# EAGLE design MachineLearning-MM-Carrier (EAGLE 9.6.2)
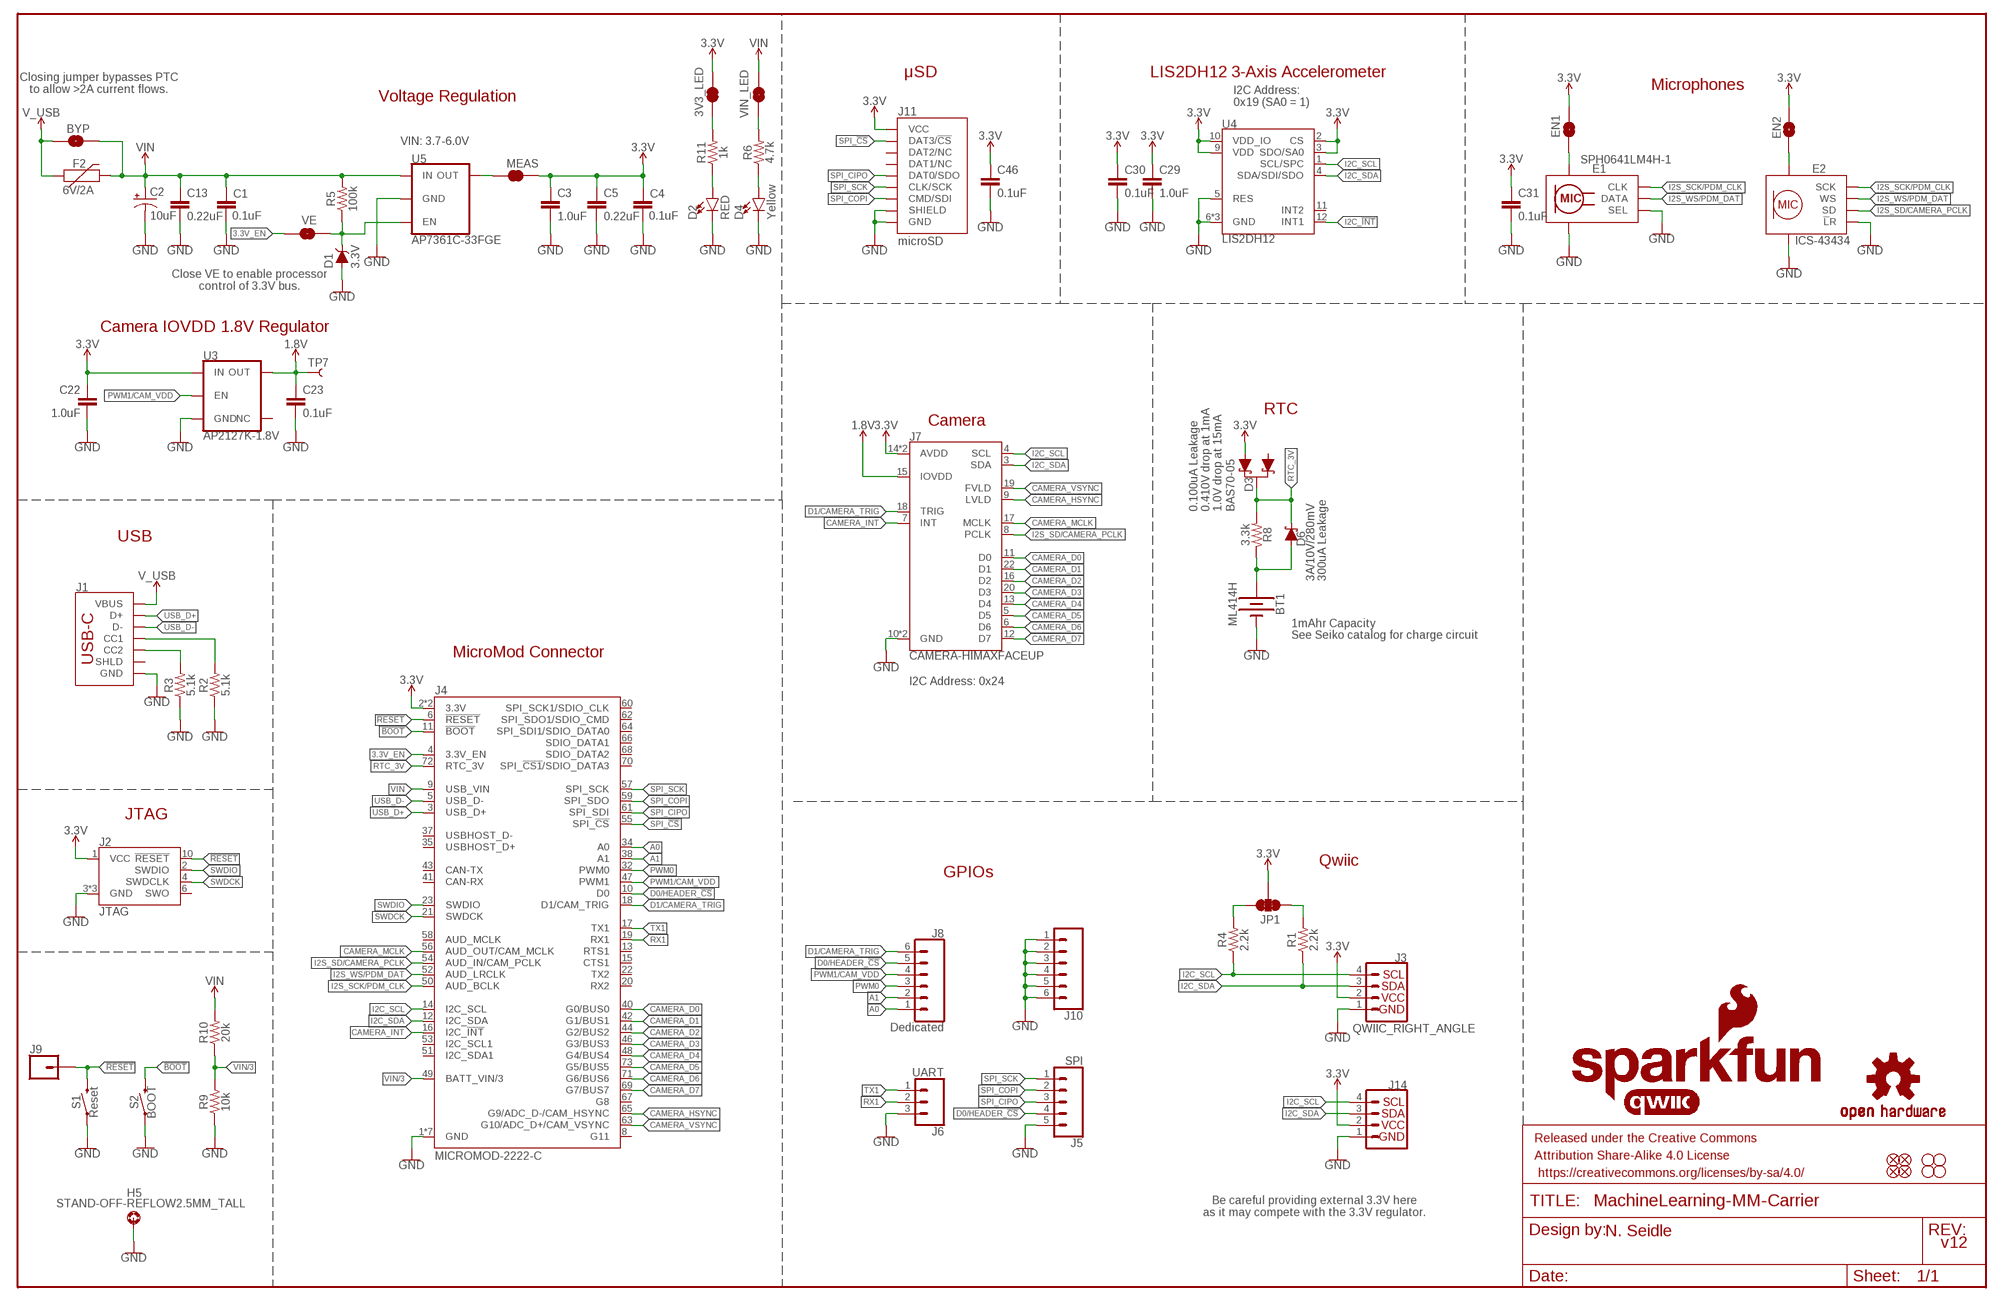
[diagram p0: schematic, sheet 1]

## Parts
3V3_LED  JUMPER-SMT_2_NC_TRACE_SILK  [SMT-JUMPER_2_NC_TRACE_SILK]
BT1  ML414H  ML414H_IV01E_BATTERY  [ML414H_IV01E]
BYP  JUMPER-SMT_2_NO_SILK  [SMT-JUMPER_2_NO_SILK]
C1  0.1uF  0.1UF-0603-25V-(+80/-20%)  [0603]
C2  10uF  10UF-POLAR-EIA3216-16V-10%(TANT)  [EIA3216]
C3  1.0uF  1.0UF-0603-16V-10%  [0603]
C4  0.1uF  0.1UF-0603-25V-(+80/-20%)  [0603]
C5  0.22uF  0.22UF-0603-25V-10%  [0603]
C13  0.22uF  0.22UF-0603-25V-10%  [0603]
C22  1.0uF  1.0UF-0603-16V-10%  [0603]
C23  0.1uF  0.1UF-0603-100V-10%  [0603]
C29  1.0uF  1.0UF-0603-16V-10%  [0603]
C30  0.1uF  0.1UF-0603-25V-(+80/-20%)  [0603]
C31  0.1uF  0.1UF-0603-25V-(+80/-20%)  [0603]
C46  0.1uF  0.1UF-0603-25V-(+80/-20%)  [0603]
D1  3.3V  DIODE-ZENER-MM3Z3V3T1G  [SOD-323]
D2  RED  LED-RED0603  [LED-0603]
D3  BAS70-05  DIODE-SCHOTTKY-DUAL  [SOT23-3]
D4  Yellow  LED-YELLOW0603  [LED-0603]
D6  3A/10V/280mV  DIODE-SCHOTTKY-BAT60A  [SOD-323]
E1  SPH0641LM4H-1  SPH0641LM4H-1_MICROPHONE  [SPH0641LM4H-1_MICROPHONE]
E2  ICS-43434  [ICS-43434]
EN1  JUMPER-SMT_2_NC_TRACE_SILK  [SMT-JUMPER_2_NC_TRACE_SILK]
EN2  JUMPER-SMT_2_NO_SILK  [SMT-JUMPER_2_NO_SILK]
F2  6V/2A  PPTC_6V2A  [1210]
FD1  FIDUCIALUFIDUCIAL  [FIDUCIAL-MICRO]
FD2  FIDUCIALUFIDUCIAL  [FIDUCIAL-MICRO]
FD3  FIDUCIALUFIDUCIAL  [FIDUCIAL-MICRO]
FD4  FIDUCIALUFIDUCIAL  [FIDUCIAL-MICRO]
FRAME1  FRAME-LEDGER  [CREATIVE_COMMONS]
H1  STAND-OFF  [STAND-OFF]
H2  STAND-OFF  [STAND-OFF]
H3  STAND-OFF  [STAND-OFF]
H4  STAND-OFF  [STAND-OFF]
H5  STAND-OFF-REFLOW2.5MM_TALL  [STAND-OFF-REFLOW-M2.5]
J1  USB_C_2-LAYER_PADS  [USB-C-16P-2LAYER-PADS]
J2  JTAG  CORTEX_JTAG_DEBUG_MINIMUM_PTH  [2X5-PTH-1.27MM]
J3  QWIIC_RIGHT_ANGLE  QWIIC_CONNECTORJS-1MM  [JST04_1MM_RA]
J4  MICROMOD-2222-C  [M.2-CONNECTOR-E]
J5  SPI  CONN_05NO_SILK  [1X05_NO_SILK]
J6  UART  CONN_031X03_NO_SILK  [1X03_NO_SILK]
J7  CAMERA-HIMAXFACEUP  [FPC05024-42201]
J8  Dedicated  CONN_06NO_SILK_NO_POP  [1X06_NO_SILK]
J9  CONN_01PTH_NO_SILK_YES_STOP  [1X01_NO_SILK]
J10  CONN_06NO_SILK_NO_POP  [1X06_NO_SILK]
J11  microSD  MICRO-SD-SDIOPUSH-PUSH  [MICRO-SD-SOCKET]
J14  I2C_STANDARD_NO_SILK  [1X04_NO_SILK]
JP1  JUMPER-SMT_3_2-NC_TRACE_SILK  [SMT-JUMPER_3_2-NC_TRACE_SILK]
LOGO1  SFE_LOGO_NAME_FLAME.1_INCH  [SFE_LOGO_NAME_FLAME_.1]
LOGO2  QWIIC_LOGO_CONNECTOR  [QWIIC_5.5MM]
LOGO3  OSHW-LOGOMINI  [OSHW-LOGO-MINI]
MEAS  JUMPER-COMBO_2_NC_TRACE  [COMBO-JUMPER_2_NC_TRACE]
R1  2.2k  2.2KOHM-0603-1/10W-1%  [0603]
R2  5.1k  5.1KOHM5.1KOHM-0603-1/10W-1%  [0603]
R3  5.1k  5.1KOHM5.1KOHM-0603-1/10W-1%  [0603]
R4  2.2k  2.2KOHM-0603-1/10W-1%  [0603]
R5  100k  100KOHM-0603-1/10W-1%  [0603]
R6  4.7k  4.7KOHM-0603-1/10W-1%  [0603]
R8  3.3k  3.3KOHM-0603-1/10W-1%  [0603]
R9  10k  10KOHM-0603-1/10W-1%  [0603]
R10  20k  20KOHM-0603-1/10W-1%  [0603]
R11  1k  1KOHM-0603-1/10W-1%  [0603]
S1  Reset  MOMENTARY-SWITCH-SPST-SMD-5.2-TALL-REDUNDANT  [TACTILE_SWITCH_SMD_5.2MM]
S2  BOOT  MOMENTARY-SWITCH-SPST-SMD-5.2-TALL-REDUNDANT  [TACTILE_SWITCH_SMD_5.2MM]
TP7  TEST-POINT3X5  [PAD.03X.05]
U3  AP2127K-1.8V  V_REG_AP2127K-1.8V  [SOT23-5]
U4  LIS2DH12  [LGA-12-LISDH12]
U5  AP7361C-33FGE  AP7361C-33FGEUDFN-8  [UDFN-8]
VE  JUMPER-SMT_2_NO_SILK  [SMT-JUMPER_2_NO_SILK]
VIN_LED  JUMPER-SMT_2_NC_TRACE_SILK  [SMT-JUMPER_2_NC_TRACE_SILK]

## Nets
1.8V: C23.1 J7.15(IOVDD) TP7.P$1 U3.5(OUT)
3.3V: 3V3_LED.2 C3.1 C4.1 C5.1 C22.1 C29.1 C30.1 C31.1 C46.1 D3.2(A1) EN1.2 EN2.2 J2.1(VCC) J3.2 J4.2(3.3V) J4.74(3.3V) J7.14(AVDD) J7.21(AVDD) J11.VCC J14.2 JP1.2 MEAS.2 MEAS.4 U3.1(IN) U4.2(CS) U4.3(SDO/SA0) U4.9(VDD) U4.10(VDD_IO)
3.3V_EN: J4.4(3.3V_EN) VE.1
!BOOT!: J4.11(!BOOT!) S2.3 S2.4
!RESET!: J2.10(!RESET) J4.6(!RESET!) J9.1 S1.3 S1.4
A0: J4.34(A0) J8.1
A1: J4.38(A1) J8.2
CAMERA_D0: J4.40(G0/BUS0) J7.11(D0)
CAMERA_D1: J4.42(G1/BUS1) J7.22(D1)
CAMERA_D2: J4.44(G2/BUS2) J7.16(D2)
CAMERA_D3: J4.46(G3/BUS3) J7.20(D3)
CAMERA_D4: J4.48(G4/BUS4) J7.13(D4)
CAMERA_D5: J4.73(G5/BUS5) J7.5(D5)
CAMERA_D6: J4.71(G6/BUS6) J7.6(D6)
CAMERA_D7: J4.69(G7/BUS7) J7.12(D7)
CAMERA_HSYNC: J4.65(G9/ADC_D-/CAM_HSYNC) J7.9(LVLD)
CAMERA_INT: J4.16(I2C_!INT!) J7.7(INT)
CAMERA_MCLK: J4.56(AUD_OUT/CAM_MCLK) J7.17(MCLK)
CAMERA_VSYNC: J4.63(G10/ADC_D+/CAM_VSYNC) J7.19(FVLD)
D0/HEADER_!CS!: J4.10(D0) J5.4 J8.5
D1/CAMERA_TRIG: J4.18(D1/CAM_TRIG) J7.18(TRIG) J8.6
GND: BT1.- C1.2 C2.- C3.2 C4.2 C5.2 C13.2 C22.2 C23.2 C29.2 C30.2 C31.2 C46.2 D1.A D2.C D4.C E1.2(SEL) E1.3(GND) E1.6(GND) E1.7(GND) E1.8(GND) E2.2(!L!R) E2.3(GND) E2.7(GND) E2.8(GND) E2.9(GND) H5.1 J1.GND J1.GND2(GND) J2.3(GND) J2.5(GND) J2.9(GND) J3.1 J4.1(GND) J4.7(GND) J4.33(GND) J4.36(GND) J4.39(GND) J4.45(GND) J4.75(GND) J5.5 J6.3 J7.10(GND) J7.23(GND) J10.1 J10.2 J10.3 J10.4 J10.5 J10.6 J11.CD1(SHIELD) J11.GND J11.GND1(GND) J11.GND3(GND) J14.1 R2.1 R3.1 R9.1 S1.1 S1.2 S2.1 S2.2 U3.2(GND) U4.5(RES) U4.6(GND) U4.7(GND) U4.8(GND) U5.4(GND) U5.EP(GND)
I2C_!INT!: U4.12(INT1)
I2C_SCL: J3.4 J4.14(I2C_SCL) J7.4(SCL) J14.4 R4.1 U4.1(SCL/SPC)
I2C_SDA: J3.3 J4.12(I2C_SDA) J7.3(SDA) J14.3 R1.1 U4.4(SDA/SDI/SDO)
I2S_SCK/PDM_CLK: E1.4(CLK) E2.4(SCK) J4.50(AUD_BCLK)
I2S_SD/CAMERA_PCLK: E2.6(SD) J4.54(AUD_IN/CAM_PCLK) J7.8(PCLK)
I2S_WS/PDM_DAT: E1.1(DATA) E2.1(WS) J4.52(AUD_LRCLK)
N$1: R6.2 VIN_LED.1
N$2: JP1.3 R4.2
N$3: JP1.1 R1.2
N$4: E1.5(VDD) EN1.1
N$5: E2.5(VDD) EN2.1
N$6: 3V3_LED.1 R11.2
N$7: D2.A R11.1
N$8: D4.A R6.1
N$10: J1.A5(CC1) R2.2
N$11: J1.B5(CC2) R3.2
N$12: D1.C R5.1 U5.5(EN) VE.2
N$14: BT1.+ D6.A R8.1
PWM0: J4.32(PWM0) J8.3
PWM1/CAM_VDD: J4.47(PWM1) J8.4 U3.3(EN)
RTC_3V: D3.3(C) D6.C J4.72(RTC_3V) R8.2
RX1: J4.19(RX1) J6.2
SPI_!CS!: J4.55(SPI_!CS!) J11.CS/DAT3(DAT3/!CS!)
SPI_CIPO: J4.61(SPI_SDI) J5.3 J11.DO/DAT0(DAT0/SDO)
SPI_COPI: J4.59(SPI_SDO) J5.2 J11.DI/CMD(CMD/SDI)
SPI_SCK: J4.57(SPI_SCK) J5.1 J11.SCLK(CLK/SCK)
SWDCK: J2.4(SWDCLK) J4.21(SWDCK)
SWDIO: J2.2(SWDIO) J4.23(SWDIO)
TX1: J4.17(TX1) J6.1
USB_D+: J1.A6(D+) J1.B6(D+) J4.3(USB_D+)
USB_D-: J1.A7(D-) J1.B7(D-) J4.5(USB_D-)
V_USB: BYP.1 F2.1 J1.VBUS1(VBUS) J1.VBUS2(VBUS)
VIN: BYP.2 C1.1 C2.+ C13.1 F2.2 J4.9(USB_VIN) R5.2 R10.2 U5.8(IN) VIN_LED.2
VIN/3: J4.49(BATT_VIN/3) R9.2 R10.1
VREG_3.3V: MEAS.1 MEAS.3 U5.1(OUT)
Unconnected: D3.1(A) J1.SHLD1(SHLD) J1.SHLD2(SHLD) J1.SHLD3(SHLD) J1.SHLD4(SHLD) J2.6(SWO) J4.8(G11) J4.13(RTS1) J4.15(CTS1) J4.20(RX2) J4.22(TX2) J4.35(USBHOST_D+) J4.37(USBHOST_D-) J4.41(CAN-RX) J4.43(CAN-TX) J4.51(I2C_SDA1) J4.53(I2C_SCL1) J4.58(AUD_MCLK) J4.60(SPI_SCK1/SDIO_CLK) J4.62(SPI_SDO1/SDIO_CMD) J4.64(SPI_SDI1/SDIO_DATA0) J4.66(SDIO_DATA1) J4.67(G8) J4.68(SDIO_DATA2) J4.70(SPI_!CS1!/SDIO_DATA3) J7.MNT1 J7.MNT2 J11.DAT1(DAT1/NC) J11.DAT2(DAT2/NC) U3.4(NC) U4.11(INT2)

## Notes on the sheet
- μSD | LIS2DH12 3-Axis Accelerometer
- Closing jumper bypasses PTC
  to allow >2A current flows.
- Microphones
- Voltage Regulation
- I2C Address:
  0x19 (SA0 = 1)
- VIN: 3.7-6.0V
- Close VE to enable processor
  control of 3.3V bus.
- Camera IOVDD 1.8V Regulator
- RTC
- Camera
- 0.100uA Leakage
  0.410V drop at 1mA
  1.0V drop at 15mA
- USB
- 300uA Leakage
- 1mAhr Capacity
- See Seiko catalog for charge circuit
- MicroMod Connector
- I2C Address: 0x24
- JTAG
- Qwiic
- GPIOs
- Be careful providing external 3.3V here
  as it may compete with the 3.3V regulator.
- N. Seidle
- v12

## Library data of the parts
3V3_LED EN1 VIN_LED = SparkFun-Jumpers:JUMPER-SMT_2_NC_TRACE: Normally closed trace jumper This jumper has a trace between two pads so it's normally closed (NC). Use a razor knife to open the connection. For best results follow the IPC guidelines for cutting traces: Cutout at least 0.063 mm (0.005 in). Remove all loose material to clean up the cut area. Seal the cut with an approved epoxy. Reapply solder to reclose the connection.
BT1 = SparkFun-Batteries:ML414H_IV01E_BATTERY: SEIKO ML414H-IV01E Reflowable Lithium Battery ML414H is a rechargeable, coin type battery with features such as Pb-free reflowable (Peak temperature: 260 C) and high temperature heat resistance. Battery Characteristics: 3.1V max voltage Voff is 2V 1mAH 3k series resistor with battery 72 hour charge time from 2.0-3.1V 2.3-2.8V initial charge; PROD_ID: BATT-14267
BYP EN2 VE = SparkFun-Jumpers:JUMPER-SMT_2_NO: Normally open jumper This jumper has two pads in close proximity to each other. Apply solder to close the connection. Round pads are easier to solder for beginners, but are a lot larger. SparkFun Product that uses the round pads: SparkFun EL Sequencer <https://www.sparkfun.com/products/12781>
C1 C4 C30 C31 C46 = SparkFun-Capacitors:0.1UF: 0.1µF ceramic capacitors A capacitor is a passive two-terminal electrical component used to store electrical energy temporarily in an electric field.; PROD_ID: CAP-00810
C2 = SparkFun-Capacitors:10UF-POLAR: 10.0µF polarized capacitors A capacitor is a passive two-terminal electrical component used to store electrical energy temporarily in an electric field.; PROD_ID: CAP-00811
C3 C22 C29 = SparkFun-Capacitors:1.0UF: 1µF ceramic capacitors A capacitor is a passive two-terminal electrical component used to store electrical energy temporarily in an electric field.; PROD_ID: CAP-00868
C5 C13 = SparkFun-Capacitors:0.22UF: 0.22µF ceramic capacitors A capacitor is a passive two-terminal electrical component used to store electrical energy temporarily in an electric field.; PROD_ID: CAP-07822
C23 = SparkFun-Capacitors:0.1UF: 0.1µF ceramic capacitors A capacitor is a passive two-terminal electrical component used to store electrical energy temporarily in an electric field.; PROD_ID: CAP-08390
D1 = SparkFun-DiscreteSemi:DIODE-ZENER: Zener Diode A Zener diode allows current to flow from its anode to its cathode like a normal semiconductor diode, but it also permits current to flow in the reverse direction when its "Zener voltage" is reached. - WIkipedia; PROD_ID: DIO-11284
D2 = SparkFun-LED:LED-RED: Red SMD LED Used in manufacturing of most products at SparkFun Packages: 0603 - SMD 0603 package [Product Link] <http://docs.avagotech.com/docs/AV02-0551EN> 0603 SMART - SMD 0603 SMART package ( more efficient and expensive)[Product Link] <http://www.osram-os.com/Graphics/XPic2/00077099_0.pdf> 1206 - SMD1206 package [Product Link] <https://www.sparkfun.com/datasheets/DevTools/LilyPad/Q150OVS4.pdff> SparkFun Products: Pro Mini 328 -5V <https://www.sparkfun.com/products/821> RedBoard <https://www.sparkfun.com/products/12757> IOIO-OTG <https://www.sparkfun.com/products/13613>; PROD_ID: DIO-00819
D3 = SparkFun-DiscreteSemi:DIODE-SCHOTTKY-DUAL: Diodes Incorporated - BAS70-05 Dual Schottky Diode Two Schottky Diodes in a single SOT-23 package. Low reverse current (100 nA) Vf: Datasheet referenced for footprint <https://www.diodes.com/assets/Datasheets/ds11007.pdf>; PROD_ID: DIO-14829
D4 = SparkFun-LED:LED-YELLOW: Yellow SMD LED Used in manufacturing several products at SparkFun. Packages: 0603 - SMD 0603 package[Product Link] <http://www.kingbrightusa.com/product.asp?catalog_name=LED&product_id=APT1608SYCK> 0603 -SMART - SMART SMD 0603 package (more efficient/more expensive) [Product Link] <http://www.osram-os.com/osram_os/en/products/product-catalog/led-light-emitting-diodes/smartled-0603/ly-l29k/index.jsp> LilyPad - SMD1206 package[Product Datasheet] <https://www.sparkfun.com/datasheets/DevTools/LilyPad/Q150YUS4.pdf> SparkFun Products: Blynk Board <https://www.sparkfun.com/products/13794> IOIO-OTG <https://www.sparkfun.com/products/13613> XBee Explorer Serial <https://www.sparkfun.com/products/13225>; PROD_ID: DIO-09003
D6 = SparkFun-DiscreteSemi:DIODE-SCHOTTKY: Schottky diode A Schottky diode is a semiconductor diode which has a low forward voltage drop and a very fast switching action.; PROD_ID: DIO-14072
E1 = SparkFun-Sensors:SPH0641LM4H-1_MICROPHONE: SPH0641LM4H-1 Microphone A miniature, high-performance, low power, bottom port silicon digital microphone with a single bit PDM output.; PROD_ID: IC-14361
E2 = Teensy:ICS-43434; PROD_ID: COMP-14898
F2 = SparkFun-Fuses:PPTC: Resettable Fuse PPTC Resettable Fuse. Really a sort of resistor with a polymeric positive temperature coefficient whose resistance increases dramatically with an increase in temperature. When heated by the power passing through the resistance rises causing the current to be limited, protecting the circuit. This is achieved by the transition of the polymer from a crystalline to an amorphous state where the conductive carbon separates breaking the conductive pathways found in the cool crystalline structure. When a PPTC cools back down it resumes conducting letting the circuit turn back on. SparkFun Products: SparkFun RedBoard - Programmed with Arduino <https://www.sparkfun.com/products/12757> Pro Micro - 5V/16MHz <https://www.sparkfun.com/products/12640> Arduino Pro 328 - 5V/16MHz <https://www.sparkfun.com/products/10915> MP3 Trigger <https://www.sparkfun.com/products/13720>; PROD_ID: RES-14313
FD1-FD4 = SparkFun-Aesthetics:FIDUCIAL: Fiducial Alignment Points Point-of-reference for pick-and-place machines and other optical instruments.
FRAME1 = SparkFun-Aesthetics:FRAME-LEDGER: Schematic Frame - Ledger Standard 11x14 US Ledger frame
H1-H4 = SparkFun-Hardware:STAND-OFF: Stand Off Drill holes for mechanically mounting via screws, standoffs, etc. Note: Use the keepout ring to avoid running the screw head into surrounding components. Variant Overviews STAND-OFF - Mechanical footprint for a #4 phillips button head screw. STAND-OFF-TIGHT - Mechanical footprint for a #4 phillips button head screw, Example SparkFun Products Screw - Phillips Head (1/4", 4-40, 10 pack) <https://www.sparkfun.com/products/10453> (PRT-10453) Screw - Phillips Head (1/2", 4-40, 10 pack) <https://www.sparkfun.com/products/10452> (PRT-10452) Screw - Phillips Head (3/4", 4-40, 10 pack) <https://www.sparkfun.com/products/10451> (PRT-10451) Screw - Phillips Head (1", 4-40, 10 pack) <https://www.sparkfun.com/products/10450> (PRT-10450)
H5 = SparkFun-Hardware:STAND-OFF-REFLOW: Stand Off Reflow Compatible A metal standoff that can be placed and reflowed onto a PCB.; PROD_ID: HW-14899
J1 = SparkFun-Connectors:USB_C: USB Type C 16Pin Connector Super Speed pins not available on the 16-pin purely SMD connector so this part is best for USB 2.0 implementations. D1 and D2 are tied together enabling D+/- no matter which way the cable is plugged into the connector. The two channel configuration pins (CC1/2) are exposed. These are normally connected to ground via 5.1k resistors but can be reconfigured for high current/high power applications.; PROD_ID: CONN-14122
J2 = SparkFun-Connectors:CORTEX_JTAG_DEBUG_MINIMUM: Cortex Debug Connector - 10 pin Supports JTAG debug, Serial Wire debug, and Serial Wire Viewer. PTH and SMD connector options available. General Connector Information <http://infocenter.arm.com/help/topic/com.arm.doc.faqs/attached/13634/cortex_debug_connectors.pdf> Products: PTH Connector <http://www.digikey.com/product-detail/en/cnc-tech/3220-10-0100-00/1175-1627-ND/3883661> -via Digi-Key SparkFun PSoc <https://www.sparkfun.com/products/13229> SparkFun T <https://www.sparkfun.com/products/13810>
J3 = SparkFun-Connectors:QWIIC_CONNECTOR: SparkFun I2C Standard Qwiic Connector An SMD 1mm pitch JST connector makes it easy and quick (get it? Qwiic?) to connect I2C devices to each other. The Qwiic system <http://www.sparkfun.com/qwiic> enables fast and solderless connection between popular platforms and various sensors and actuators. We carry 200mm <https://www.sparkfun.com/products/14204>, 100mm <https://www.sparkfun.com/products/14205>, 50mm <https://www.sparkfun.com/products/14206>, and breadboard friendly <https://www.sparkfun.com/products/14207> Qwiic cables. We also offer 10 pcs strips <https://www.sparkfun.com/products/14323> the SMD connectors.; PROD_ID: CONN-13694
J4 = SparkFun-MicroMod:MICROMOD: MicroMod Connector Description: A card edge connector and mating PCB connector to allow various MicroMod Processor Boards to be coupled with various carrier boards of different capabilities. Based on the M.2 standard.; PROD_ID: CONN-14877
J5 = SparkFun-Connectors:CONN_05: Multi connection point. Often used as Generic Header-pin footprint for 0.1 inch spaced/style header connections On any of the 0.1 inch spaced packages, you can populate with these: Break Away Headers - Straight <https://www.sparkfun.com/products/116> (PRT-00116) Break Away Male Headers - Right Angle <https://www.sparkfun.com/products/553> (PRT-00553) Female Headers <https://www.sparkfun.com/products/115> (PRT-00115) Break Away Headers - Machine Pin <https://www.sparkfun.com/products/117> (PRT-00117) Break Away Female Headers - Swiss Machine Pin <https://www.sparkfun.com/products/743> (PRT-00743) For SCREWTERMINALS and SPRING TERMINALS visit here: Screw Terimnals on SparkFun.com <https://www.sparkfun.com/search/results?term=Screw+Terminals> (5mm/3.5mm/2.54mm spacing) This device is also useful as a general connection point to wire up your design to another part of your project. Our various solder wires solder well into these plated through hole pads. Hook-Up Wire - Assortment (Stranded, 22 AWG) <https://www.sparkfun.com/products/11375> (PRT-11375) Hook-Up Wire - Assortment (Solid Core, 22 AWG) <https://www.sparkfun.com/products/11367> (PRT-11367) View the entire wire category on our website here <https://www.sparkfun.com/categories/141> Special notes: Molex polarized connector foot print use with SKU : PRT-08231 with associated crimp pins and housings. 1MM SMD Version SKU: PRT-10208
J6 = SparkFun-Connectors:CONN_03: Multi connection point. Often used as Generic Header-pin footprint for 0.1 inch spaced/style header connections On any of the 0.1 inch spaced packages, you can populate with these: Break Away Headers - Straight <https://www.sparkfun.com/products/116> (PRT-00116) Break Away Male Headers - Right Angle <https://www.sparkfun.com/products/553> (PRT-00553) Female Headers <https://www.sparkfun.com/products/115> (PRT-00115) Break Away Headers - Machine Pin <https://www.sparkfun.com/products/117> (PRT-00117) Break Away Female Headers - Swiss Machine Pin <https://www.sparkfun.com/products/743> (PRT-00743) Stackable Header - 3 Pin (Female, 0.1") <https://www.sparkfun.com/products/13875> (PRT-13875) For SCREWTERMINALS and SPRING TERMINALS visit here: Screw Terimnals on SparkFun.com <https://www.sparkfun.com/search/results?term=Screw+Terminals> (5mm/3.5mm/2.54mm spacing) This device is also useful as a general connection point to wire up your design to another part of your project. Our various solder wires solder well into these plated through hole pads. Hook-Up Wire - Assortment (Stranded, 22 AWG) <https://www.sparkfun.com/products/11375> (PRT-11375) Hook-Up Wire - Assortment (Solid Core, 22 AWG) <https://www.sparkfun.com/products/11367> (PRT-11367) View the entire wire category on our website here <https://www.sparkfun.com/categories/141> Special notes: Molex polarized connector foot print use with SKU : PRT-08232 with associated crimp pins and housings.
J7 = SparkFun-Connectors:CAMERA-HIMAX
J8 J10 = SparkFun-Connectors:CONN_06: Multi connection point. Often used as Generic Header-pin footprint for 0.1 inch spaced/style header connections On any of the 0.1 inch spaced packages, you can populate with these: Break Away Headers - Straight <https://www.sparkfun.com/products/116> (PRT-00116) Break Away Male Headers - Right Angle <https://www.sparkfun.com/products/553> (PRT-00553) Female Headers <https://www.sparkfun.com/products/115> (PRT-00115) Break Away Headers - Machine Pin <https://www.sparkfun.com/products/117> (PRT-00117) Break Away Female Headers - Swiss Machine Pin <https://www.sparkfun.com/products/743> (PRT-00743) Arduino Stackable Header - 6 Pin <https://www.sparkfun.com/products/9280> (PRT-09280) For SCREWTERMINALS and SPRING TERMINALS visit here: Screw Terimnals on SparkFun.com <https://www.sparkfun.com/search/results?term=Screw+Terminals> (5mm/3.5mm/2.54mm spacing) This device is also useful as a general connection point to wire up your design to another part of your project. Our various solder wires solder well into these plated through hole pads. Hook-Up Wire - Assortment (Stranded, 22 AWG) <https://www.sparkfun.com/products/11375> (PRT-11375) Hook-Up Wire - Assortment (Solid Core, 22 AWG) <https://www.sparkfun.com/products/11367> (PRT-11367) View the entire wire category on our website here <https://www.sparkfun.com/categories/141>
J9 = SparkFun-Connectors:CONN_01: Single connection point. Often used as Generic Header-pin footprint for 0.1 inch spaced/style header connections On any of the 0.1 inch spaced packages, you can populate with these: Break Away Headers - Straight <https://www.sparkfun.com/products/116> (PRT-00116) Break Away Male Headers - Right Angle <https://www.sparkfun.com/products/553> (PRT-00553) Female Headers <https://www.sparkfun.com/products/115> (PRT-00115) Break Away Headers - Machine Pin <https://www.sparkfun.com/products/117> (PRT-00117) Break Away Female Headers - Swiss Machine Pin <https://www.sparkfun.com/products/743> (PRT-00743) This device is also useful as a general connection point to wire up your design to another part of your project. Our various solder wires solder well into these plated through hole pads. Hook-Up Wire - Assortment (Stranded, 22 AWG) <https://www.sparkfun.com/products/11375> (PRT-11375) Hook-Up Wire - Assortment (Solid Core, 22 AWG) <https://www.sparkfun.com/products/11367> (PRT-11367) View the entire wire category on our website here <https://www.sparkfun.com/categories/141> Special notes: SMTSO-256-ET is a "flush mount" nut for a 4-40 screw. We mostly use this on specialty testbeds; it is a nice way to connect hardware to your PCB at an adjustable hieght. Also note, the SNAP packages are for using a snappable style connector. We sell a baggie of snaps and they are also used on two LilyPad designs: Snap Assortment - 30 pack (male and female) <https://www.sparkfun.com/products/11347> (DEV-11347) LilyPad Arduino SimpleSnap <https://www.sparkfun.com/products/10941> (DEV-10941) LilyPad SimpleSnap Protoboard <https://www.sparkfun.com/products/10940> (DEV-10940)
J11 = SparkFun-Connectors:MICRO-SD-SDIO: microSD Socket for Transflash Push-push type µSD socket. tDoc lines correctly indicate media card edge positions when inserting (unlocked, locked, depressed). NOTE: CD1 and CD2 are connected internally, and the default detect state of the socket is detect pin to ground. SparkFun Products: WAV Trigger <https://www.sparkfun.com/products/13660> CAN-Bus Shield <https://www.sparkfun.com/products/13262> SparkFun Level Shifing microSD Breakout <https://www.sparkfun.com/products/13743>; PROD_ID: CONN-07820
J14 = SparkFun-Connectors:I2C_STANDARD: SparkFun I2C Standard Pinout Header SparkFun has standardized on a pinout for all I2C based sensor breakouts. This pinout allows I2C boards to be plugged directly into the headers on Arduino Uno compatible boards, and to be daisy chained easily. Example SparkFun Products: SparkFun Atmospheric Sensor Breakout - BME280 <https://www.sparkfun.com/products/13676> SparkFun Altitude/Pressure Sensor Breakout - MPL3115A2 <https://www.sparkfun.com/products/11084> SparkFun TOF Range Finder Sensor - VL6180 <https://www.sparkfun.com/products/12785>
JP1 = SparkFun-Jumpers:JUMPER-SMT_3_2-NC_TRACE: Normally closed trace jumper (2 of 2 connections) This jumper has a trace between all three pads so they are normally closed (NC). Use a razor knife to open the connection(s). For best results follow the IPC guidelines for cutting traces: Cutout at least 0.063 mm (0.005 in). Remove all loose material to clean up the cut area. Seal the cut with an approved epoxy. Reapply solder to reclose the connection(s).
LOGO1 = SparkFun-Aesthetics:SFE_LOGO_NAME_FLAME: SparkFun Font Logo w/ Flame This is the SparkFun full logo. The logo on the schematic will always be the same size; the package variant is the height of the flame part of the logo. Default layer for the logo on the board is tSilk.
LOGO2 = SparkFun-Aesthetics:QWIIC_LOGO: Qwiic Logos for placement on schematic and PCB. The 5.5mm silk logo is best for placing next to Qwiic connector.
LOGO3 = SparkFun-Aesthetics:OSHW-LOGO: Open-Source Hardware (OSHW) Logo This logo indicates the piece of hardware it is found on incorporates a OSHW license and/or adheres to the definition of open source hardware found here: http://freedomdefined.org/OSHW
MEAS = SparkFun-Jumpers:JUMPER-COMBO_2_NC_TRACE
R1 R4 = SparkFun-Resistors:2.2KOHM: 2.2kΩ resistor A resistor is a passive two-terminal electrical component that implements electrical resistance as a circuit element. Resistors act to reduce current flow, and, at the same time, act to lower voltage levels within circuits. - Wikipedia; PROD_ID: RES-08272
R2 R3 = SparkFun-Resistors:5.1KOHM; PROD_ID: RES-12083
R5 = SparkFun-Resistors:100KOHM: 100kΩ resistor A resistor is a passive two-terminal electrical component that implements electrical resistance as a circuit element. Resistors act to reduce current flow, and, at the same time, act to lower voltage levels within circuits. - Wikipedia; PROD_ID: RES-07828
R6 = SparkFun-Resistors:4.7KOHM: 4.7kΩ resistor A resistor is a passive two-terminal electrical component that implements electrical resistance as a circuit element. Resistors act to reduce current flow, and, at the same time, act to lower voltage levels within circuits. - Wikipedia; PROD_ID: RES-07857
R8 = SparkFun-Resistors:3.3KOHM: 3.3kΩ resistor A resistor is a passive two-terminal electrical component that implements electrical resistance as a circuit element. Resistors act to reduce current flow, and, at the same time, act to lower voltage levels within circuits. - Wikipedia; PROD_ID: RES-07851
R9 = SparkFun-Resistors:10KOHM: 10kΩ resistor A resistor is a passive two-terminal electrical component that implements electrical resistance as a circuit element. Resistors act to reduce current flow, and, at the same time, act to lower voltage levels within circuits. - Wikipedia; PROD_ID: RES-00824
R10 = SparkFun-Resistors:20KOHM: 20kΩ resistor A resistor is a passive two-terminal electrical component that implements electrical resistance as a circuit element. Resistors act to reduce current flow, and, at the same time, act to lower voltage levels within circuits. - Wikipedia; PROD_ID: RES-09383
R11 = SparkFun-Resistors:1KOHM: 1kΩ resistor A resistor is a passive two-terminal electrical component that implements electrical resistance as a circuit element. Resistors act to reduce current flow, and, at the same time, act to lower voltage levels within circuits. - Wikipedia; PROD_ID: RES-07856
S1 S2 = SparkFun-Switches:MOMENTARY-SWITCH-SPST: Momentary Switch (Pushbutton) - SPST Normally-open (NO) SPST momentary switches (buttons, pushbuttons). Variants PTH-12MM - 12mm square, through-hole Momentary Pushbutton Switch - 12mm Square <https://www.sparkfun.com/products/9190> (COM-09190) PTH-6.0MM, PTH-6.0MM-KIT - 6.0mm square, through-hole Mini Pushbutton Switch <https://www.sparkfun.com/products/97> (COM-00097) KIT package intended for soldering kit's - only one side of pads' copper is exposed. PTH-RIGHT-ANGLE-KIT - Right-angle, through-hole Right Angle Tactile Button <https://www.sparkfun.com/products/10791> - Used on SparkFun BigTime Watch Kit <https://www.sparkfun.com/products/11734> SMD-12MM - 12mm square, surface-mount Tactile Button - SMD (12mm) <https://www.sparkfun.com/products/12993> (COM-12993) Used on SparkFun PicoBoard <https://www.sparkfun.com/products/11888> SMD-4.5MM - 4.5mm Square Trackball Switch Used on SparkFun Blackberry Trackballer Breakout <https://www.sparkfun.com/products/13169> SMD-4.6MMX2.8MM - 4.60mm x 2.80mm, surface mount Used on SparkFun SAMD21 Mini Breakout <https://www.sparkfun.com/products/13664> SMD-5.2MM, SMD-5.2-REDUNDANT - 5.2mm square, surface-mount Mini Pushbutton Switch - SMD <https://www.sparkfun.com/products/8720> (COM-08720) Used on Arduino Pro Mini <https://www.sparkfun.com/products/11114> REDUNDANT package connects both switch circuits together SMD-6.0X3.5MM - 6.0 x 3.5mm, surface mount Momentary Reset Switch SMD <https://www.sparkfun.com/products/8229> (COM-08229) SMD-6.2MM-TALL - 6.2mm square, surface mount Tactile Button - SMD (6mm) <https://www.sparkfun.com/products/12992> Used on SparkFun Digital Sandbox <https://www.sparkfun.com/products/12651> SMD-RIGHT-ANGLE - Right-angle, surface mount Used on SparkFun Block for Intel® Edison - Arduino <https://www.sparkfun.com/products/13036>; PROD_ID: SWCH-14139
TP7 = SparkFun-Connectors:TEST-POINT: SparkFun Test Points Bare copper test points for troubleshooting or In-Circuit-Testing. These are used by our Production team for verifying production board runs using pogo-pins on test beds. SparkFun Products: SparkFun LSM9DS1 Breakout <https://www.sparkfun.com/products/13284> SparkFun PSOC <https://www.sparkfun.com/products/13714> SparkFun Load Cell Amplifier <https://www.sparkfun.com/products/13879>
U3 = SparkFun-IC-Power:V_REG_AP2127: AP2127 - 300mA CMOS LDO Regulator w/ Enable The AP2127 is CMOS process low dropout linear regulator with enable function, the regulator delivers a guaranteed 300mA (min.) continuous load current. Features Output Voltage Accuracy: ±1.5% Output Current: 300mA (Min.) Foldback Short Current Protection: 50mA Enable Function to Turn ON/OFF VOUT Low Dropout Voltage (3.3V): 250mV (Typ.) @IOUT=600mA Excellent Load Regulation: 0.2%/A (Typ.) Excellent Line Regulation: 0.02%/V (Typ.) Low Quiescent Current: 55μA (Typ.) Low Standby Current: 0.01μA (Typ.) Low Output Noise: 50μVRMS PSRR: 100Hz -65dB, 1kHz -65dB OTSD Protection Stable with 1.0μF Flexible Cap: Ceramic, Tantalum and Aluminum Electrolytic Operation Temperature Range: -40°C to 85°C ESD: MM 400V, HBM 4000V; PROD_ID: VREG-14239
U4 = SparkFun-Sensors:LIS2DH12; DIGIKEY: 497-14851-2-ND; PROD_ID: IC-14229
U5 = SparkFun-IC-Power:AP7361C-33FGE: AP7361C 3.3V LDO Regulator; PROD_ID: VREG-14094

## Net classes
0 default: width 0 mm, drill 0 mm
1 power: width 0.762 mm

## Board
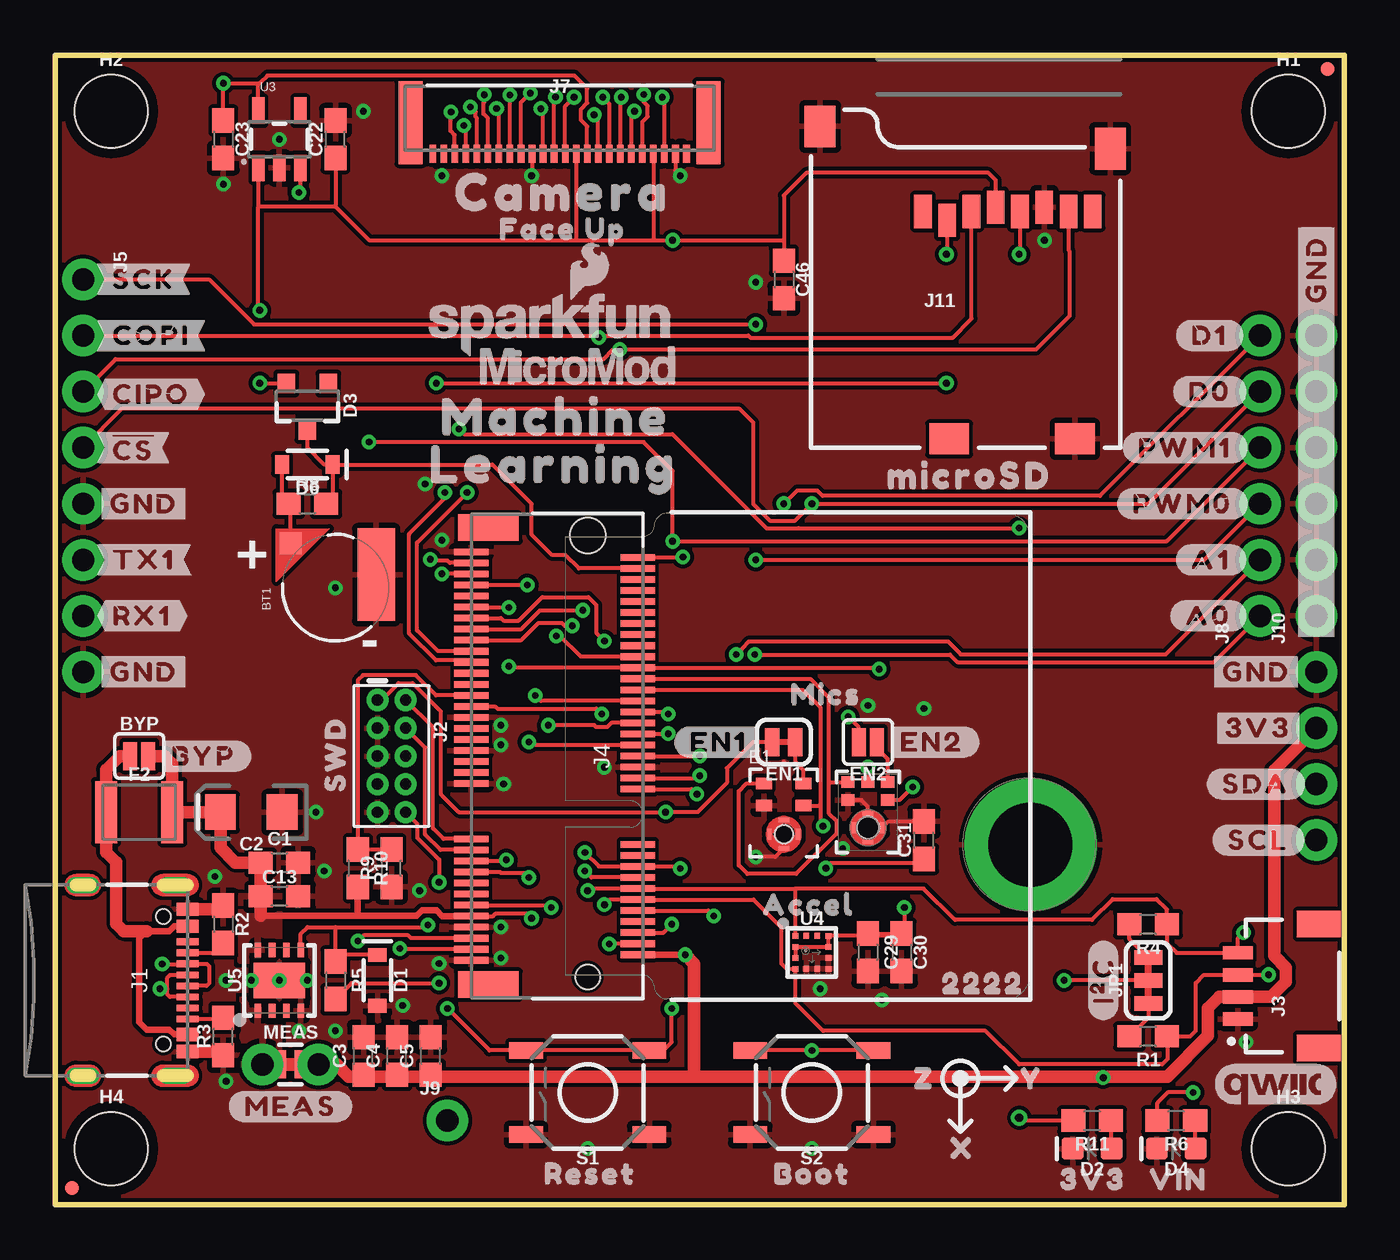
[diagram p1: board, top side]
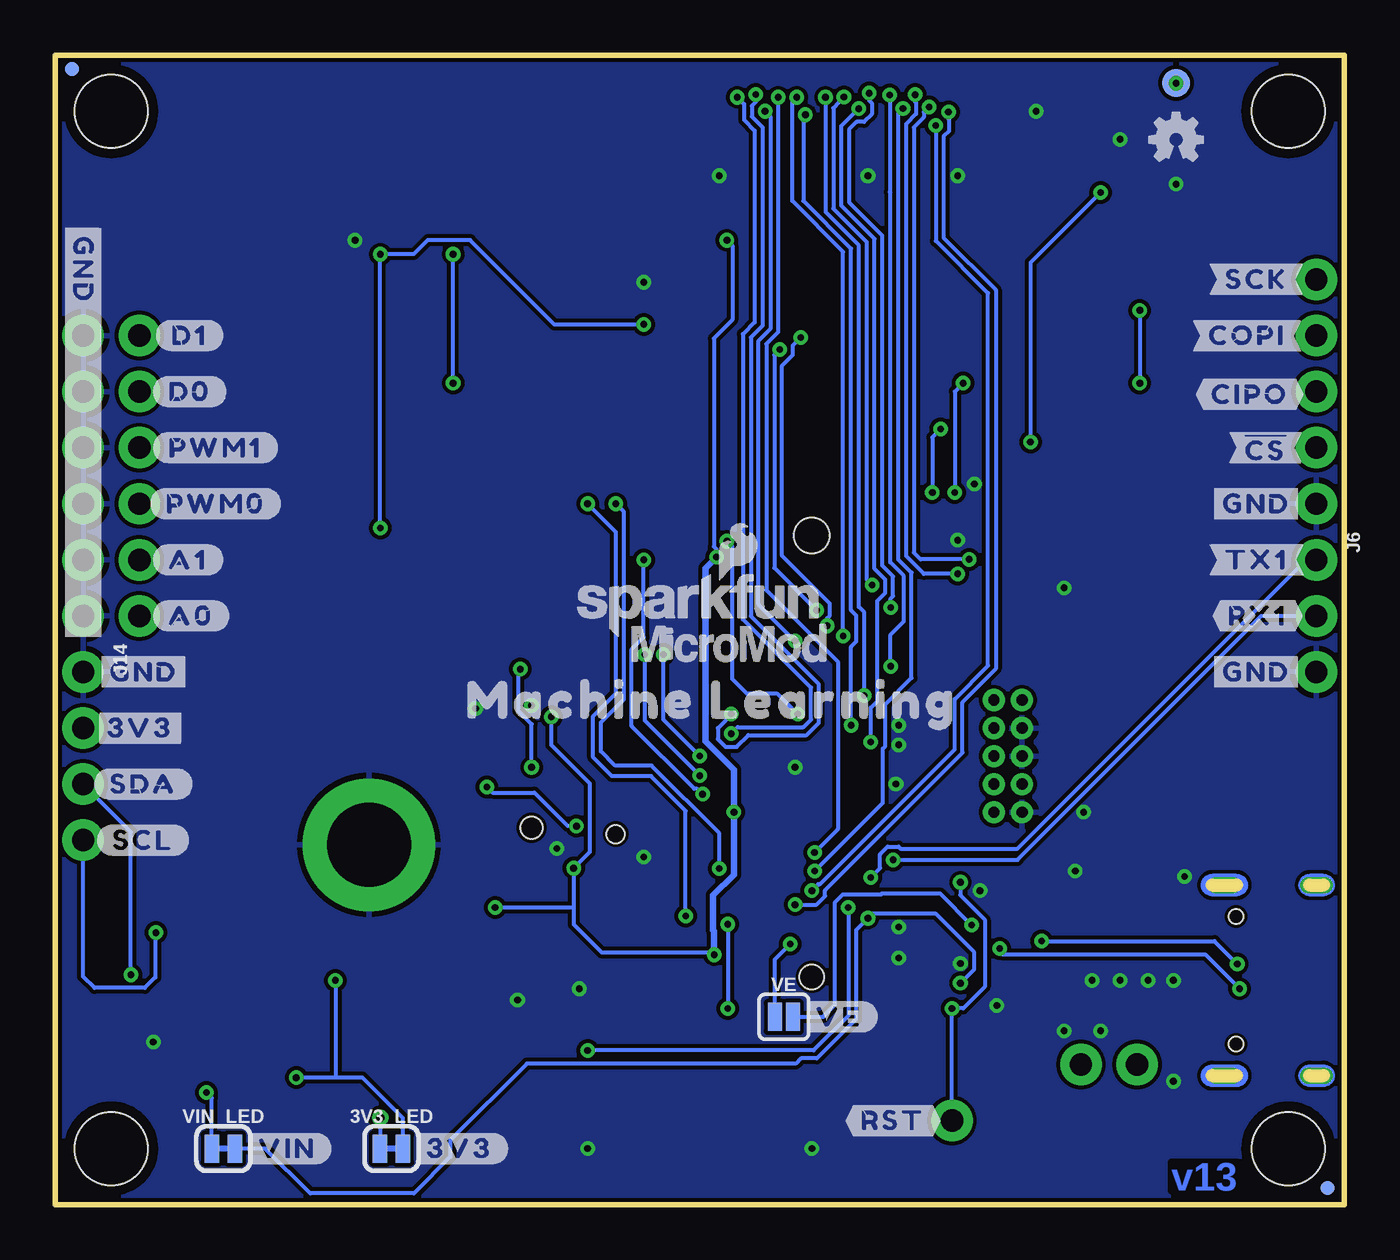
[diagram p2: board, bottom side, seen from below]

Size 58.42 x 52.07 mm. Coordinates in mm from the lower left corner, seen from the top.
Outline: 0,0 0,52.07 58.42,52.07 58.42,0 0,0
Copper layers (1*16): Top 0.035mm / dielectric 1.5mm / Bottom 0.035mm
Design rules "SparkFun-2-layer-TIGHT *": minimum track width 7mil, minimum drill 12mil, track to track 7mil, track to pad 7mil, pad to pad 7mil, via to via 7mil, smd to smd 7mil, copper to edge 7mil, drill to drill 7mil, minimum pad ring 7mil, minimum via ring 7mil, stop-mask expansion 4mil, vias tented up to drill 25mil, thermal gap 10mil

### Footprints (pad centres in the part's own frame; a part is rotated, then mirrored left to right if it is on the bottom)
SMT-JUMPER_2_NC_TRACE_SILK = smd 0.66 x 1.27: 1 -0.521,0; 2 0.521,0
ML414H_IV01E = smd 1 x 1: + 2.022,2.032 | smd 4.2 x 1.7: - 0.6,-1.85
SMT-JUMPER_2_NO_SILK = smd 0.635 x 1.27: 1 -0.406,0; 2 0.406,0
0603 = smd 1.1 x 1: 1 -0.85,0; 2 0.85,0
EIA3216 = smd 1.4 x 1.6: + 1.4,0; - -1.4,0
SOD-323 = smd 0.63 x 0.83: A 1.15,0; C -1.15,0
LED-0603 = smd 1 x 1: A -0.877,0; C 0.877,0
SOT23-3 = smd 0.8 x 0.9: 1 -0.95,-1; 2 0.95,-1; 3 0,1.1
SPH0641LM4H-1_MICROPHONE = smd 0.725 x 0.522: 1 -0.9,1.3; 2 -0.9,0.3; 4 0.9,0.3; 5 0.9,1.3 | smd 0.5 x 0.2: 3 0,-1.65; 8 0,-0.35 | smd 0.2 x 0.5: 6 -0.65,-1; 7 0.65,-1 | hole 0.8: 0,-1
ICS-43434 = smd 0.522 x 0.6: 1 -1.364,-0.9; 2 -0.542,-0.9; 4 -0.542,0.9; 5 -1.364,0.9; 6 -1.364,0 | smd 0.2 x 0.5: 3 1.36,0; 8 0.06,0 | smd 0.5 x 0.2: 7 0.71,0.65; 9 0.71,-0.65 | hole 1: 0.71,0
1210 = smd 1 x 2.8: 1 -1.5,0; 2 1.5,0
FIDUCIAL-MICRO = smd 0.635 x 0.635: 1 0,0
STAND-OFF = hole 3.302: 0,0
STAND-OFF-REFLOW-M2.5 = drill 3.8 pad 6: 1 0,0
USB-C-16P-2LAYER-PADS = smd 0.3 x 1: A5 -1.25,-0.34; A6 -0.25,-0.34; A7 0.25,-0.34; A8 1.25,-0.34; B5 1.75,-0.34; B6 0.75,-0.34; B7 -0.75,-0.34; B8 -1.75,-0.34 | smd 0.6 x 1: GND -3.225,-0.34; GND2 3.225,-0.34; VBUS1 -2.45,-0.34; VBUS2 2.45,-0.34 | drill 0.4 pad 0.6 long: SHLD1 -4.318,-0.915; SHLD2 4.318,-0.915; SHLD3 -4.318,-5.095; SHLD4 4.318,-5.095 | hole 0.65: -2.89,-1.445; 2.89,-1.445
2X5-PTH-1.27MM = drill 0.508 pad 1: 1 -2.54,-0.635; 2 -2.54,0.635; 3 -1.27,-0.635; 4 -1.27,0.635; 5 0,-0.635; 6 0,0.635; 7 1.27,-0.635; 8 1.27,0.635; 9 2.54,-0.635; 10 2.54,0.635
JST04_1MM_RA = smd 0.6 x 1.35: 1 -1.5,0; 2 -0.5,0; 3 0.5,0; 4 1.5,0 | smd 1.2 x 2: NC1 2.8,-3.675; NC2 -2.8,-3.675
M.2-CONNECTOR-E = smd 0.3 x 1.55: 1 9.25,-5.275; 2 9,2.275; 3 8.75,-5.275; 4 8.5,2.275; 5 8.25,-5.275; 6 8,2.275; 7 7.75,-5.275; 8 7.5,2.275; 9 7.25,-5.275; 10 7,2.275; 11 6.75,-5.275; 12 6.5,2.275; 13 6.25,-5.275; 14 6,2.275; 15 5.75,-5.275; 16 5.5,2.275; 17 5.25,-5.275; 18 5,2.275; 19 4.75,-5.275; 20 4.5,2.275; 21 4.25,-5.275; 22 4,2.275; 23 3.75,-5.275; 32 1.5,2.275; 33 1.25,-5.275; 34 1,2.275; 35 0.75,-5.275; 36 0.5,2.275; 37 0.25,-5.275; 38 0,2.275; 39 -0.25,-5.275; 40 -0.5,2.275; 41 -0.75,-5.275; 42 -1,2.275; 43 -1.25,-5.275; 44 -1.5,2.275; 45 -1.75,-5.275; 46 -2,2.275; 47 -2.25,-5.275; 48 -2.5,2.275; 49 -2.75,-5.275; 50 -3,2.275; 51 -3.25,-5.275; 52 -3.5,2.275; 53 -3.75,-5.275; 54 -4,2.275; 55 -4.25,-5.275; 56 -4.5,2.275; 57 -4.75,-5.275; 58 -5,2.275; 59 -5.25,-5.275; 60 -5.5,2.275; 61 -5.75,-5.275; 62 -6,2.275; 63 -6.25,-5.275; 64 -6.5,2.275; 65 -6.75,-5.275; 66 -7,2.275; 67 -7.25,-5.275; 68 -7.5,2.275; 69 -7.75,-5.275; 70 -8,2.275; 71 -8.25,-5.275; 72 -8.5,2.275; 73 -8.75,-5.275; 74 -9,2.275; 75 -9.25,-5.275 | smd 1.2 x 2.75: A1 10.35,-4.5; A2 -10.35,-4.5 | hole 1.1: 10,0 | hole 1.6: -10,0
1X05_NO_SILK = drill 1.016 pad 1.88: 1 0,0; 2 2.54,0; 3 5.08,0; 4 7.62,0; 5 10.16,0
1X03_NO_SILK = drill 1.016 pad 1.88: 1 0,0; 2 2.54,0; 3 5.08,0
FPC05024-42201 = smd 0.3 x 0.8: 1 5.75,0.4; 2 5.25,0.4; 3 4.75,0.4; 4 4.25,0.4; 5 3.75,0.4; 6 3.25,0.4; 7 2.75,0.4; 8 2.25,0.4; 9 1.75,0.4; 10 1.25,0.4; 11 0.75,0.4; 12 0.25,0.4; 13 -0.25,0.4; 14 -0.75,0.4; 15 -1.25,0.4; 16 -1.75,0.4; 17 -2.25,0.4; 18 -2.75,0.4; 19 -3.25,0.4; 20 -3.75,0.4; 21 -4.25,0.4; 22 -4.75,0.4; 23 -5.25,0.4; 24 -5.75,0.4 | smd 1.1 x 3.75: MNT1 -6.75,-1; MNT2 6.75,-1
1X06_NO_SILK = drill 1.016 pad 1.88: 1 0,0; 2 2.54,0; 3 5.08,0; 4 7.62,0; 5 10.16,0; 6 12.7,0
1X01_NO_SILK = drill 1.016 pad 1.88: 1 0,0
MICRO-SD-SOCKET = smd 1.8 x 1.4: CD1 -2.05,0.4; CD2 -7.75,0.4 | smd 0.8 x 1.5: CS/DAT3 -7.84,10.3; DAT1 -1.24,10.7; DAT2 -8.94,10.7; DI/CMD -6.74,10.7; DO/DAT0 -2.34,10.7; GND -3.44,10.9; SCLK -4.54,10.7; VCC -5.64,10.9 | smd 1.4 x 1.9: GND1 -13.6,14.55; GND3 -0.45,13.55
1X04_NO_SILK = drill 1.016 pad 1.88: 1 0,0; 2 2.54,0; 3 5.08,0; 4 7.62,0
SMT-JUMPER_3_2-NC_TRACE_SILK = smd 0.66 x 1.27: 1 -1.041,0; 2 0,0; 3 1.041,0
COMBO-JUMPER_2_NC_TRACE = smd 0.635 x 1.27: 1 -0.508,0; 2 0.508,0 | drill 1.016 pad 1.88: 3 -1.27,0; 4 1.27,0
TACTILE_SWITCH_SMD_5.2MM = smd 1.524 x 0.762: 1 -2.794,1.905; 2 2.794,1.905; 3 -2.794,-1.905; 4 2.794,-1.905
PAD.03X.05 = smd 1.27 x 1.27: P$1 0,0
SOT23-5 = smd 0.55 x 1.2: 1 -0.95,-1.3; 2 0,-1.3; 3 0.95,-1.3; 4 0.95,1.3; 5 -0.95,1.3
LGA-12-LISDH12 = smd 0.275 x 0.25: 1 -0.75,0.75; 2 -0.75,0.25; 3 -0.75,-0.25; 4 -0.75,-0.75; 7 0.75,-0.75; 8 0.75,-0.25; 9 0.75,0.25; 10 0.75,0.75 | smd 0.25 x 0.275: 5 -0.25,-0.75; 6 0.25,-0.75; 11 0.25,0.75; 12 -0.25,0.75
UDFN-8 = smd 0.3 x 0.65: 1 -0.975,-1.375; 2 -0.325,-1.375; 3 0.325,-1.375; 4 0.975,-1.375; 5 0.975,1.375; 6 0.325,1.375; 7 -0.325,1.375; 8 -0.975,1.375 | smd 2.35 x 1.6: EP 0,0

### Placement (x,y rotation side)
3V3_LED  43.18,2.54 0 bottom
BT1  12.7,27.94 90 top
BYP  3.81,20.32 0 top
C1  10.16,15.49 0 top
C2  8.89,17.78 180 top
C3  13.97,6.73 90 top
C4  15.49,6.73 90 top
C5  17.02,6.73 90 top
C13  10.16,13.97 0 top
C22  12.7,48.26 90 top
C23  7.62,48.26 270 top
C29  36.83,11.43 270 top
C30  38.35,11.43 270 top
C31  39.37,16.51 90 top
C46  33.02,41.91 270 top
D1  14.61,10.16 270 top
D2  46.99,2.54 180 top
D3  11.43,36.2 180 top
D4  50.8,2.54 180 top
D6  11.43,33.53 180 top
E1  33.02,17.78 0 top
E2  36.83,17.78 270 top
EN1  33.02,20.95 180 top
EN2  36.83,20.95 180 top
F2  3.81,17.78 0 top
FD1  0.76,0.76 0 top
FD2  57.66,51.44 0 top
FD3  0.76,0.76 0 bottom
FD4  57.66,51.44 0 bottom
FRAME1  1.27,-10.16 0 top  (outside the outline)
H1  55.88,49.53 0 top
H2  2.54,49.53 0 top
H3  55.88,2.54 0 top
H4  2.54,2.54 0 top
H5  44.2,16.3 0 top
J1  6.35,10.16 270 top
J2  15.24,20.32 270 top
J3  53.59,9.91 90 top
J4  24.13,20.32 270 top
J5  1.27,41.91 270 top
J6  1.27,29.21 270 bottom
J7  22.86,48.01 180 top
J8  54.61,26.67 90 top
J9  17.78,3.81 0 top
J10  57.15,26.67 90 top
J11  48.26,34.29 0 top
J14  57.15,24.13 270 bottom
JP1  49.53,10.16 90 top
LOGO1  22.48,39.88 0 top
LOGO2  55.31,5.46 0 top
LOGO3  7.62,48.26 0 bottom
LOGO4  SFE_LOGO_NAME_FLAME.1_INCH  [SFE_LOGO_NAME_FLAME_.1]  29.21,27.18 0 bottom
MEAS  10.67,6.35 0 top
R1  49.53,7.62 180 top
R2  7.62,12.7 270 top
R3  7.62,7.62 90 top
R4  49.53,12.7 180 top
R5  12.7,10.16 270 top
R6  50.8,3.81 180 top
R8  11.43,31.75 0 top
R9  15.24,15.24 90 top
R10  13.72,15.24 270 top
R11  46.99,3.81 180 top
S1  24.13,5.08 180 top
S2  34.29,5.08 180 top
TP7  7.62,50.8 0 bottom
U3  10.16,48.26 0 top
U4  34.29,11.43 0 top
U5  10.16,10.16 0 top
U$1  [#EN1#3]  28.07,20.95 0 top
U$2  [#EN2#4]  37.59,20.95 0 top
U$3  [CAMERA0]  16.89,45.85 0 top
U$4  [#3V3#0]  42.29,2.54 0 bottom
U$5  [MICS0]  32.64,23.11 0 top
U$6  [#A0#5]  50.55,26.67 0 top
U$7  [#A0#5]  53.98,26.67 0 bottom
U$8  [#A1#4]  50.8,29.21 0 top
U$9  [#A1#4]  53.98,29.21 0 bottom
U$10  [#D0#1]  53.98,36.83 0 bottom
U$11  [#GND#0]  57.15,40.13 90 top
U$12  [#GND#0]  57.15,44.58 270 bottom
U$13  [#3V3#1]  52.32,21.59 0 top
U$14  [#3V3#1]  56.77,21.59 0 bottom
U$15  [#GND#0]  52.2,24.13 0 top
U$16  [#GND#0]  56.64,24.13 0 bottom
U$17  [#RST#1]  22.61,3.81 0 bottom
U$18  [#VE#0]  24.64,8.51 0 bottom
U$19  [#MEAS#2]  7.87,4.45 0 top
U$20  [#VIN#1]  49.91,2.54 0 bottom
U$21  [SWD0]  12.7,18.03 90 top
U$22  [FACE_UP0]  19.43,44.2 0 top
U$23  [#I�C#0]  47.5,8.38 90 top
U$24  [MICROMOD_LOGO_.35]  23.62,37.97 0 top
U$25  [#D0#1]  50.67,36.83 0 top
U$26  [MACHINE0]  16.26,35.69 0 top
U$27  [LEARNING1]  15.75,33.53 0 top
U$28  [MICROSD0]  36.83,33.02 0 top
U$29  [#D1#0]  50.8,39.37 0 top
U$30  [LEARNING1]  29.97,22.86 0 bottom
U$31  [#D1#0]  53.85,39.37 0 bottom
U$32  [#PWM0#3]  48.13,31.75 0 top
U$33  [#BYP#1]  4.57,20.32 0 top
U$34  [MICROMOD_LOGO_.35]  27.94,25.4 0 bottom
U$35  [##CS##3]  1.91,34.29 0 top
U$36  [3V37]  44.83,1.14 0 top
U$37  [MACHINE0]  41.02,22.86 0 bottom
U$38  [22223]  39.5,10.03 0 top
U$39  [ACCEL4]  31.37,13.59 0 top
U$40  [BOOT5]  31.88,1.4 0 top
U$41  [#PWM0#3]  54.1,31.75 0 bottom
U$42  [#PWM1#2]  48.39,34.29 0 top
U$43  [#SCL#3]  52.45,16.51 0 top
U$44  [#SCL#3]  56.52,16.51 0 bottom
U$45  [RESET6]  21.46,1.4 0 top
U$46  [VIN8]  48.9,1.14 0 top
U$47  [X1]  39.88,2.54 0 top
U$48  [Y2]  43.05,5.71 0 top
U$49  [#PWM1#2]  53.98,34.29 0 bottom
U$50  [#SDA#2]  52.2,19.05 0 top
U$51  [#SDA#2]  56.64,19.05 0 bottom
U$52  [Z0]  38.23,5.71 0 top
U$68  [##CS##3]  5.21,34.29 0 bottom
U$69  [#CIPO#2]  6.73,36.7 0 bottom
U$70  [#CIPO#2]  1.91,36.7 0 top
U$71  [#COPI#1]  1.91,39.37 0 top
U$72  [#COPI#1]  6.86,39.37 0 bottom
U$73  [#GND#4]  1.78,31.75 0 top
U$74  [#GND#4]  6.22,31.75 0 bottom
U$75  [#RX1#6]  1.91,26.67 0 top
U$76  [#RX1#6]  5.97,26.67 0 bottom
U$77  [#SCK#0]  1.91,41.91 0 top
U$78  [#SCK#0]  6.1,41.91 0 bottom
U$79  [#TX1#5]  1.91,29.21 0 top
U$80  [#TX1#5]  6.1,29.21 0 bottom
U$81  [#GND#4]  1.78,24.13 0 top
U$82  [#GND#4]  6.22,24.13 0 bottom
VE  25.4,8.51 0 bottom
VIN_LED  50.8,2.54 0 bottom

### Tracks (layer width: path | path; a pad name or v marks a point on that pad's centre or on a via)
1.8V  (via drill 0.3)
  Top 0.178: C23.1 TP7.P$1 9.27,50.8 | U3.5 9.21,50.74 9.27,50.8 | 9.27,50.8 9.62,51.15 23.53,51.15 24.11,50.57 24.11,49.91 23.82,49.62 23.82,49.13 24.11,48.84 J7.15
  other vias: 7.62,50.8
3.3V  (via drill 0.3)
  Top 0.178: 23.62,43.69 14.22,43.69 12.7,45.21 | 23.62,43.69 27.05,43.69 | 27.05,43.69 v27.98,43.69 33.02,43.69 | U4.3 U4.2 U4.9 U4.10 36.73,12.18 | J11.VCC 42.62,46.41 42.29,46.74 34.04,46.74 33.02,45.72 33.02,43.69 | 33.02,43.69 C46.1 | 36.73,12.18 C29.1 C30.1 | 36.73,12.18 38.48,12.18 v38.48,13.46 | v47.5,5.75 47.5,5.8 | MEAS.2 MEAS.4 | JP1.2 v45.72,10.16 | J2.1 14.79,22.86 15.56,23.63 16.19,23.63 17.48,22.34 17.48,18.59 18.29,17.78 v27.66,17.78 29.11,17.78 30.44,19.11 30.44,19.77 31.62,20.95 EN1.2 | v9.27,40.51 9.21,40.57 9.21,45.21 | U3.1 9.21,45.21 | J4.74 28.43,29.32 v28.45,29.34 | D3.2 9.29,37.2 v9.27,37.21 | v34.92,15.24 35.15,15.47 39.18,15.47 C31.1 | EN2.2 36.42,21.61 v35.94,22.1 | 12.7,45.21 9.21,45.21 | C22.1 12.7,45.21 | J7.14 23.61,43.7 23.62,43.69 | J7.21 27.11,43.75 27.05,43.69
  Top 0.254: C3.1 13.97,5.8 | C4.1 15.49,5.8 | C5.1 17.02,5.8
  Top 0.305: J4.2 v28.56,11.32
  Top 0.559: 28.96,5.8 17.02,5.8 15.49,5.8 13.97,5.8 13.3,5.8 12.75,6.35 MEAS.4 | 28.96,5.8 47.5,5.8 50.39,5.8 52.23,7.65 52.23,8.89 52.75,9.41 J3.2 55.1,9.41 55.78,10.09 55.78,10.74 55.24,11.27 55.24,19.68 J14.2 | v28.56,11.32 28.96,10.92 28.96,5.8
  Bottom 0.178: v27.98,43.69 27.74,43.45 27.74,40.08 28.57,39.24 28.57,29.8 28.45,29.68 v28.45,29.34 | v9.27,40.51 v9.27,37.21 | 3V3_LED.2 42.66,3.92 44.49,5.75 45.76,5.75 | 45.76,5.75 v47.5,5.75 | 45.76,5.75 45.72,5.79 v45.72,10.16 | 34.92,13.46 v34.92,15.24 34.2,15.96 34.2,19.09 35.94,20.83 v35.94,22.1 | 34.92,13.46 34.92,12.7 33.66,11.43 28.67,11.43 v28.56,11.32 | v38.48,13.46 34.92,13.46
  Bottom 0.305: v28.56,11.32 28.56,12.38 28.6,12.43 28.6,14.01 27.66,14.95 v27.66,17.78 27.66,19.7 28.96,21 28.96,28.83 v28.45,29.34
3.3V_EN  (via drill 0.3)
  Top 0.178: v25.11,11.81 v25.12,11.82 J4.4
  Bottom 0.178: VE.1 25.81,11.11 v25.11,11.81
!BOOT!  (via drill 0.3)
  Top 0.178: v22.48,13.46 22.37,13.57 J4.11 | S2.4 v34.29,6.99 S2.3
  Bottom 0.178: v22.48,13.46 22.48,8.55 24.05,6.99 v34.29,6.99
!RESET!  (via drill 0.3)
  Top 0.178: v27.94,12.7 27.56,12.32 J4.6 | v17.78,8.89 19.68,6.99 S1.4 S1.3 27.56,6.99 27.94,7.37 v27.94,8.89 | J2.10 16.41,17.25 16.41,16.62 17.4,15.63 v17.4,14.61
  Bottom 0.178: v27.94,12.7 v27.94,8.89 | v17.4,14.61 17.4,14.02 16.29,12.91 16.29,9.87 17.27,8.89 v17.78,8.89 J9.1
A0  (via drill 0.3)
  Top 0.178: J8.1 52.51,24.57 40.9,24.57 40.55,24.92 v31.7,24.92 | J4.34 29.1,19.32 v29.21,19.43
  Bottom 0.178: v29.21,19.43 31.7,21.92 v31.7,24.92
A1  (via drill 0.3)
  Top 0.178: v30.86,24.92 31.1,25.16 31.45,25.51 40.46,25.51 41.05,24.93 50.33,24.93 J8.2 | J4.38 v29.21,20.32
  Bottom 0.178: v29.21,20.32 30.86,21.97 v30.86,24.92
CAMERA_D0  (via drill 0.3)
  Top 0.178: J4.40 21.6,20.82 v21.46,20.95 | J7.11 22.11,49.55 v22.01,49.65
  Bottom 0.178: v21.46,20.95 21.46,22.51 21.16,22.81 21.16,27.36 20.8,27.71 20.8,28.31 21.29,28.8 21.29,43.75 22.8,45.27 22.8,48.86 v22.01,49.65
CAMERA_D1  (via drill 0.3)
  Top 0.178: J7.22 27.61,50.06 v27.51,50.16 | J4.42 27.77,21.32 v27.79,21.34
  Bottom 0.178: v27.51,50.16 27.2,49.86 27.2,49.13 26.72,48.65 26.72,39.96 27.25,39.43 27.25,26.51 24.17,23.42 24.17,21.98 24.52,21.63 27.5,21.63 v27.79,21.34
CAMERA_D2  (via drill 0.3)
  Top 0.178: J4.44 25.21,21.82 25.01,21.63 24.52,21.63 24.43,21.72 v22.35,21.72 | J7.16 24.61,49.19 v24.42,49.37
  Bottom 0.178: v22.35,21.72 22.35,25.27 22.11,25.51 22.11,26.68 22.35,26.93 22.35,43.31 24.51,45.47 24.51,49.28 v24.42,49.37
CAMERA_D3  (via drill 0.3)
  Top 0.178: J7.20 26.61,49.05 26.85,49.28 26.85,49.78 26.67,49.95 v26.67,50.29 | J4.46 27.69,22.32 v27.79,22.23
  Bottom 0.178: v26.67,50.29 26.67,49.95 26.85,49.78 26.85,49.28 26.36,48.8 26.36,39.82 26.9,39.28 26.9,26.66 23.81,23.57 23.81,21.83 24.37,21.27 27.01,21.27 27.54,20.74 28.04,20.74 28.38,21.09 28.38,21.58 27.79,22.18 v27.79,22.23
CAMERA_D4  (via drill 0.3)
  Top 0.178: J4.48 22,22.82 v21.75,23.06 | J7.13 23.11,49.76 v23.51,50.16
  Bottom 0.178: v21.75,23.06 21.75,26.83 22,27.07 22,43.46 23.51,44.97 v23.51,50.16
CAMERA_D5  (via drill 0.3)
  Top 0.178: J4.73 17.88,29.07 17.77,29.17 17.06,29.17 v17,29.23 | J7.5 19.11,49.2 19.05,49.26 19.05,49.49 v18.81,49.73
  Bottom 0.178: v17,29.23 19.21,29.23 19.51,29.53 19.51,48.8 19.05,49.26 19.05,49.49 v18.81,49.73
CAMERA_D6  (via drill 0.3)
  Top 0.178: J4.71 v17.53,28.57 | J7.6 19.61,49.21 19.41,49.41 19.41,49.9 19.44,49.94 v19.44,50.28
  Bottom 0.178: v17.53,28.57 19.05,28.57 19.86,29.39 19.86,48.95 19.41,49.41 19.41,49.9 19.44,49.94 v19.44,50.28
CAMERA_D7  (via drill 0.3)
  Top 0.178: J4.69 v21.4,28.07 | J7.12 22.61,50.11 v22.68,50.17
  Bottom 0.178: v21.4,28.07 21.64,28.31 21.64,43.6 23.16,45.12 23.16,49.68 22.92,49.92 22.92,49.93 v22.68,50.17
CAMERA_HSYNC  (via drill 0.3)
  Top 0.178: J4.65 20.54,27.07 v20.56,27.05 | J7.9 21.11,49.93 v21.53,50.35
  Bottom 0.178: v20.56,27.05 20.56,27.45 20.45,27.56 20.45,28.46 20.93,28.94 20.93,43.9 22.45,45.41 22.45,48.71 22.11,49.05 21.77,49.05 21.42,49.4 21.42,49.9 21.53,50.01 v21.53,50.35
CAMERA_INT  (via drill 0.3)
  Top 0.178: J4.16 24.3,14.82 v24,15.11 | J7.7 20.11,49.55 v20,49.66
  Bottom 0.178: v24,15.11 20.92,18.2 20.92,20.66 20.8,20.77 20.8,22.67 19.61,23.86 19.61,28.63 20.22,29.24 20.22,49.44 v20,49.66
CAMERA_MCLK  (via drill 0.3)
  Top 0.178: J4.56 23.82,24.82 22.86,25.78 22.73,25.78 v22.71,25.76 | v24.82,50.16 25.06,49.92 25.11,49.87 J7.17
  Bottom 0.178: v22.71,25.76 22.71,43.16 25.02,45.47 25.02,49.96 v24.82,50.16
CAMERA_VSYNC  (via drill 0.3)
  Top 0.178: J7.19 26.11,49.39 v26.25,49.53 | J4.63 20.2,26.57 20.31,26.45 21,26.45 22.07,27.52 24.16,27.52 24.51,27.17 24.51,25.91 v24.89,25.53
  Bottom 0.178: v26.25,49.53 26.01,49.29 26.01,39.67 26.54,39.14 26.54,27.18 v24.89,25.53
D0/HEADER_!CS!  (via drill 0.3)
  Top 0.178: v29.84,13.08 29.61,13.32 J4.10 | J8.5 49.53,31.75 v34.29,31.75 33.53,30.99 32.38,30.99 31.62,31.75 31.62,35.43 30.99,36.07 3.05,36.07 J5.4
  Bottom 0.178: v29.84,13.08 29.84,17.84 31.41,19.41 33.19,19.41 34.04,20.26 34.04,22.12 33.01,23.16 33.01,30.47 v34.29,31.75
D1/CAMERA_TRIG  (via drill 0.3)
  Top 0.178: v28.32,15.22 28.22,15.32 J4.18 24.64,15.32 v24.01,15.95 | J8.6 47.35,32.11 34.78,32.11 34.54,32.35 33.62,32.35 v33.02,31.75 | J7.18 25.61,50.12 v25.65,50.16
  Bottom 0.178: v28.32,15.22 28.32,16.82 31.39,19.89 33.04,19.89 33.69,20.54 33.69,21.85 32.65,22.89 32.65,31.38 v33.02,31.75 | v25.65,50.16 25.65,39.52 26.19,38.99 26.19,27.84 22.95,24.6 22.95,17.01 v24.01,15.95
GND  (via drill 0.3)
  Top 0.178: 33.02,20.07 33.07,20.02 | E2.8 E2.9 E2.3 E2.7 | E2.8 E2.7 | E2.7 37.77,17.36 C31.2 | E1.8 E1.6 E1.3 E1.7 32.64,15.75 v31.75,15.75 | E2.8 36.83,18.03 36.54,18.32 E2.2 | J7.10 21.61,46.63 v21.59,46.61 | J7.23 28.11,46.82 v28.32,46.61
  Top 0.559: J1.GND 7.46,13.38 R2.1 | J1.GND2 7.46,6.93 R3.1
  other vias: 12.7,7.87 10.16,10.16 8.89,10.16 11.43,10.16 7.75,10.16 7.24,14.86 12.19,15.11 11.81,17.78 7.75,5.59 11.05,7.87 17.4,10.92 20.19,12.57 24.89,19.81 20.19,21.72 20.19,20.83 17.53,46.61 12.7,27.94 10.16,48.26 13.97,49.53 7.62,46.23 44.83,43.69 39.37,22.48 36.83,22.61 34.67,9.78 37.47,9.27 53.98,7.37 20.19,11.18 16.51,14.22 17.53,30.1 20.32,19.05 31.75,41.78 15.75,9.02 24.13,2.54 34.29,2.54 35.69,16.13 16.76,32.64
  pour Bottom (isolate 0.178): 0,52.07 58.42,52.07 58.42,0 0,0
  pour Top (isolate 0.178, rank 3): 0,52.07 58.42,52.07 58.42,0 0,0
I2C_SCL  (via drill 0.3)
  Top 0.178: v53.85,12.32 53.59,12.06 J3.4 50.82,11.41 50.38,11.85 R4.1 50.38,13.37 49.91,13.84 47.92,13.84 46.98,12.9 40.77,12.9 39.36,14.32 33.53,14.32 | v24.13,14.22 24.23,14.32 J4.14 33.53,14.32 | 33.53,14.32 33.54,14.31 U4.1 | J7.4 18.61,48.79 v18.51,48.89
  Bottom 0.178: v53.85,12.32 53.89,12.28 53.89,10.29 54.36,9.82 56.63,9.82 57.15,10.33 J14.4 | v24.13,14.22 23.84,14.52 23.76,14.52 17.65,20.62 17.65,22.91 16.15,24.41 16.15,41.29 18.51,43.66 v18.51,48.89
I2C_SDA  (via drill 0.3)
  Top 0.178: v54.99,10.41 v54.98,10.41 J3.3 52.06,10.41 51.69,10.03 51.69,7.87 51.44,7.62 R1.1 50.42,7.58 50.42,6.6 50.16,6.35 43.69,6.35 42.16,7.87 34.8,7.87 33.54,9.13 U4.4 33.15,10.68 32.89,10.93 32.89,12.57 31.65,13.82 J4.12 25.12,13.82 v24.89,13.59 | J7.3 18.11,48.45 17.92,48.64 17.92,49.14 17.94,49.16 v17.94,49.5
  Bottom 0.178: v54.99,10.41 54.99,16.89 J14.3 | v24.89,13.59 23.92,13.59 23.53,13.98 23.53,14.24 17.3,20.47 17.3,22.76 15.79,24.27 15.79,41.44 18.16,43.81 18.16,48.39 17.92,48.63 17.92,49.14 17.94,49.16 v17.94,49.5
I2S_SCK/PDM_CLK  (via drill 0.3)
  Top 0.178: J4.50 33.88,23.32 34.67,22.52 34.67,18.03 | v38.86,18.92 38.26,18.32 E2.4 | v34.8,17.14 34.67,17.27 34.67,18.03 | E1.4 34.62,18.08 34.67,18.03
  Bottom 0.178: v34.8,17.14 35.18,17.14 36.7,18.67 38.61,18.67 v38.86,18.92
I2S_SD/CAMERA_PCLK  (via drill 0.3)
  Top 0.178: v37.34,24.26 37.27,24.32 J4.54 20.62,24.32 v20.56,24.38 | E2.6 v36.83,19.81 | J7.8 v20.61,50.26 v20.6,50.27
  Bottom 0.178: v36.83,19.81 36.83,21.76 37.43,22.36 37.43,24.17 v37.34,24.26 | v20.56,24.38 20.56,25.83 19.96,26.42 19.96,28.48 20.58,29.09 20.58,45.85 20.6,45.87 v20.6,50.27
I2S_WS/PDM_DAT
  Top 0.178: J4.52 34.22,23.82 35.05,22.99 35.05,19.14 | 35.05,19.14 E2.1 | 35.05,19.14 35.05,17.73 35.4,17.39 35.4,16.81 33.57,14.99 31.37,14.99 30.99,15.37 30.99,18.73 31.34,19.08 E1.1
N$1  (via drill 0.3)
  Top 0.178: R6.2 49.95,4.61 50.42,5.08 v51.56,5.08
  Bottom 0.178: VIN_LED.1 51.32,4.84 v51.56,5.08
N$2
  Top 0.178: R4.2 48.68,12.03 49.51,11.2 JP1.3
N$3
  Top 0.178: JP1.1 49.53,8.47 R1.2
N$4
  Top 0.178: E1.5 33.92,19.67 33.54,20.05 EN1.1
N$5
  Top 0.178: E2.5 37.73,20.18 37.24,20.68 EN2.1
N$6  (via drill 0.38)
  Top 0.178: R11.2 43.81,3.81 v43.69,3.94
  Bottom 0.178: v43.69,3.94 43.69,2.55 3V3_LED.1
N$7
  Top 0.178: R11.1 47.84,2.57 D2.A
N$8
  Top 0.178: R6.1 51.65,2.57 D4.A
N$10
  Top 0.178: J1.A5 7.18,11.41 R2.2
N$11
  Top 0.178: J1.B5 7.56,8.41 R3.2
N$12  (via drill 0.3)
  Top 0.178: U5.5 11.13,12.28 11.43,12.57 12.7,12.57 | v16.89,12.67 16.8,12.57 12.7,12.57 | D1.C 13,11.31 R5.1 12.7,12.57
  Bottom 0.178: VE.2 23.62,8.51 23.08,9.05 23.08,13.71 22.73,14.06 20.99,14.06 20.95,14.1 18.32,14.1 v16.89,12.67
N$14
  Top 0.178: BT1.+ 10.67,31.66 R8.1 10.28,32.05 D6.A
PWM0  (via drill 0.3)
  Top 0.178: v29.08,18.59 28.86,18.82 J4.32 | v31.75,29.21 52.07,29.21 J8.3
  Bottom 0.178: v29.08,18.59 29.32,18.83 29.46,18.83 32.3,21.67 32.3,25.16 31.75,25.71 v31.75,29.21
PWM1/CAM_VDD  (via drill 0.3)
  Top 0.178: v24.77,22.22 24.52,22.46 20.04,22.46 19.93,22.57 J4.47 | J8.4 50.37,30.05 v27.98,30.05 27.98,33.24 26.67,34.54 v14.22,34.54 | U3.3 11.11,45.91 v11.05,45.85
  Bottom 0.178: v24.77,22.22 25.68,23.14 27.07,23.14 27.74,23.81 27.74,29.81 v27.98,30.05 | v11.05,45.85 14.22,42.67 v14.22,34.54
RTC_3V
  Top 0.178: R8.2 12.58,32.05 D6.C | J4.72 23.73,28.82 23.12,29.43 22.52,29.43 21.59,30.35 21.59,31.75 19.81,33.53 D6.C | D6.C 12.19,33.53 11.43,34.29 D3.3
RX1  (via drill 0.3)
  Top 0.178: v20.45,15.62 20.4,15.57 J4.19
  Bottom 0.178: v20.45,15.62 14.81,15.62 3.77,26.67 J6.2
SPI_!CS!  (via drill 0.3)
  Top 0.178: J11.CS/DAT3 40.42,43.09 v40.39,43.05 | J4.55 18.77,24.65 17.26,24.65 16.04,25.87 16.04,30.39 17.65,32 v17.65,32.26 | v17.27,37.21 v40.39,37.21
  Bottom 0.178: v40.39,37.21 v40.39,43.05 | v17.65,32.26 17.65,36.83 v17.27,37.21
SPI_CIPO  (via drill 0.3)
  Top 0.178: J11.DO/DAT0 45.92,43.23 45.97,43.18 45.97,40.26 44.46,38.74 v25.59,38.74 25.29,38.74 24.85,38.3 2.74,38.3 J5.3 | J4.61 21.12,26.07 21.97,26.92 v23.91,26.92
  Bottom 0.178: v25.59,38.74 25.83,38.5 25.83,28.84 v23.91,26.92
SPI_COPI  (via drill 0.3)
  Top 0.178: J11.DI/CMD 41.53,40.13 40.68,39.28 31.5,39.28 31.41,39.37 24.55,39.37 | v23.43,26.22 23.09,26.22 22.96,26.36 21.9,26.36 21.12,25.57 J4.59 | J5.2 24.55,39.37 | v24.64,39.28 24.55,39.37
  Bottom 0.178: v23.43,26.22 23.43,26.57 23.32,26.68 23.32,27.23 25.48,29.39 25.48,38.01 24.99,38.49 24.99,38.92 v24.64,39.28
SPI_SCK  (via drill 0.3)
  Top 0.178: J11.SCLK 43.72,43.09 v43.69,43.05 | J5.1 6.98,41.91 9.01,39.88 v31.75,39.88 | J4.57 17.35,25.07 16.4,26.02 16.4,29.99 v18.67,32.26 | v18.29,35.14 18.53,34.9 27.97,34.9 32.24,30.63 33.67,30.63 33.69,30.65 v43.69,30.65
  Bottom 0.178: v43.69,30.65 v43.69,43.05 42.17,43.05 41.54,43.69 39.62,43.69 35.8,39.88 v31.75,39.88 | v18.29,35.14 18.67,34.76 v18.67,32.26
SWDCK
  Top 0.178: J2.4 16.76,20.7 16.76,16.76 17.46,16.07 J4.21
SWDIO
  Top 0.178: J2.2 17.12,21.61 17.12,17.04 17.59,16.57 J4.23
TX1  (via drill 0.3)
  Top 0.178: v21.46,14.82 21.26,15.02 20.2,15.02 20.15,15.07 J4.17
  Bottom 0.178: v21.46,14.82 21.04,15.24 21.04,15.87 20.69,16.22 20.2,16.22 20.11,16.13 14.81,16.13 1.73,29.21 J6.1
USB_D+  (via drill 0.3)
  Top 0.178: J1.B6 5.2,9.41 5.08,9.53 5.08,9.78 | 5.08,9.78 5.08,10.29 5.2,10.41 J1.A6 | v15.62,11.6 15.65,11.57 J4.3 | v4.75,9.78 5.08,9.78
  Bottom 0.178: v15.62,11.6 15.62,11.47 15.49,11.34 6.31,11.34 v4.75,9.78
USB_D-  (via drill 0.3)
  Top 0.178: J1.B7 6.1,10.91 | 6.1,10.91 6.87,10.91 6.99,10.79 6.99,10.03 6.86,9.91 J1.A7 | v4.85,10.9 6.09,10.9 6.1,10.91 | v13.72,11.94 13.97,12.2 15.99,12.2 16.12,12.07 J4.5
  Bottom 0.178: v13.72,11.94 5.89,11.94 v4.85,10.9
V_USB
  Top 0.305: J1.VBUS1 5.39,12.61 5.18,12.39 4.14,12.39 3.81,12.06 3.81,8.26 4.14,7.92 5.18,7.92 5.39,7.71 J1.VBUS2
  Top 0.559: BYP.1 2.92,20.32 2.31,19.71 F2.1 2.31,15.97 2.77,15.51 2.77,12.73 3.1,12.39 4.14,12.39
VIN  (via drill 0.3)
  Top 0.178: v21.59,12.97 21.39,13.17 19.95,13.17 19.85,13.07 J4.9 | R5.2 13.42,10.03 v17.4,10.03
  Top 0.305: 9.31,13.08 9.31,13.09 13.72,13.09 | R10.2 13.72,13.09 | 13.72,13.09 16.38,13.09 16.62,13.33 17.28,13.33 17.54,13.07 J4.9
  Top 0.559: BYP.2 4.95,20.32 5.31,19.96 F2.2 C2.+ 7.49,16.17 8.17,15.49 C1.1 C13.1 9.31,13.08
  Bottom 0.178: v17.4,10.03 16.76,10.67 16.76,11.43 18.5,13.17 21.39,13.17 v21.59,12.97 22.12,12.44 22.12,8.41 23.9,6.63 24.61,6.63 24.85,6.39 37.05,6.39 40.51,2.92 40.51,2.16 42.16,0.51 46.86,0.51 48.9,2.54 VIN_LED.2
  pour Top (isolate 0.178, rank 2): 10.16,11.05 8.38,11.05 8.38,14.35 10.16,14.35
VIN/3
  Top 0.178: R9.2 R10.1 13.72,23.75 13.95,23.98 16.34,23.98 17.25,23.07 J4.49
VREG_3.3V
  Top 0.178: MEAS.1 MEAS.3
  pour Top (isolate 0.305): 8.38,9.27 8.38,6.35 10.16,6.35 10.16,9.27

### Text on the board
Bottom: v13
tPlace: + | -
tDocu: N. Seidle